# Altium schematic sheet LED controller - v1.1.SchDoc
size A4
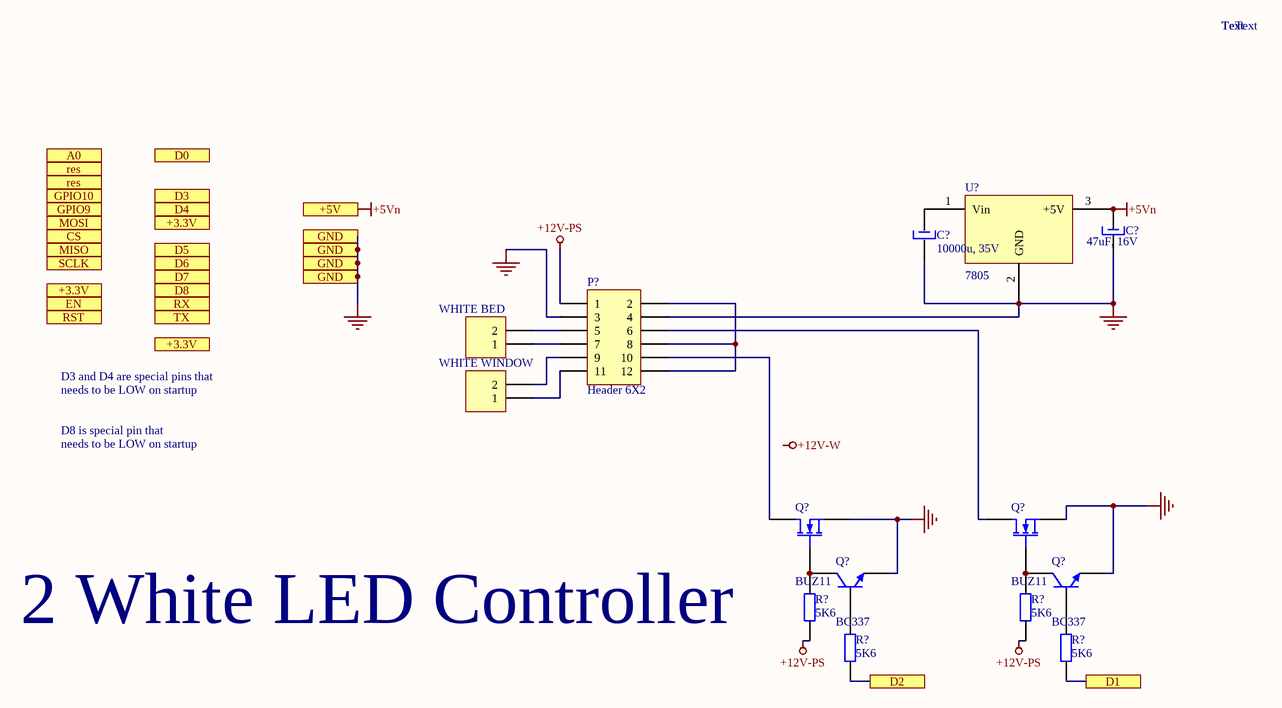
[diagram p0: LED controller - v1.1.SchDoc]

## Parts
(Parts that share a designator on the sheet are numbered #1, #2 ... from top to bottom, then left to right.)
C?#1  47uF, 16V  [Capacitor 10mikro]
C?#2  10000u, 35V  [Capacitor 10000u]
P?  Header 6X2  [HDR2X6]
Q?#1  BUZ11  [E3]
Q?#2  BUZ11  [E3]
Q?#3  BC337  [SOT-23]
Q?#4  BC337  [SOT-23]
R?#1  5K6  [SMD0805]
R?#2  5K6  [SMD0805]
R?#3  5K6  [SMD0805]
R?#4  5K6  [SMD0805]
U?  7805  [D-PAK16]
WHITE_BED  (no value)  [HDR1X2]
WHITE_WINDOW  (no value)  [HDR1X2]

## Ports
+3.3V, +5V, A0, CS, D0, D1, D2, D3, D4, D5, D6, D7, D8, EN, GND, GPIO9, GPIO10, MISO, MOSI, res, RST, RX, SCLK, TX

## Nets
+5Vn: C?#1.1 U?.3(+5V) ; port +5V
+12V-PS: P?.1 R?#1.2 R?#2.2
GND: C?#1.2 C?#2.2 P?.4 Q?#1.3(S) Q?#2.3(S) Q?#3.2(E) Q?#4.2(E) U?.2(GND) ; port GND
GND-PS: P?.3
D1: R?#4.2 ; port D1
D2: R?#3.2 ; port D2
NetC?#2_1: C?#2.1 U?.1(Vin)
NetP?_2: P?.2 P?.8 P?.12
NetP?_5: P?.5 WHITE_BED.2
NetP?_6: P?.6 Q?#2.1(D)
NetP?_7: P?.7 WHITE_BED.1
NetP?_9: P?.9 WHITE_WINDOW.2
NetP?_10: P?.10 Q?#1.1(D)
NetP?_11: P?.11 WHITE_WINDOW.1
NetQ?#1_2: Q?#1.2(G) Q?#3.3(C) R?#1.1
NetQ?#2_2: Q?#2.2(G) Q?#4.3(C) R?#2.1
NetQ?#3_1: Q?#3.1(B) R?#3.1
NetQ?#4_1: Q?#4.1(B) R?#4.1

## Notes on the sheet
- Text
- D3 and D4 are special pins that
- needs to be LOW on startup
- D8 is special pin that
- (near R?#1) 2 White LED Controller
- Labels drawn without touching a wire or pin: +12V-W

## Library data of the parts
C?#1 = Capacitor 10mikro
C?#2 = Capacitor 10000u
P? = Header 6X2: Header, 6-Pin, Dual row; LatestRevisionDate: 17-Jul-2002; LatestRevisionNote: Re-released for DXP Platform.; Publisher: Altium Limited
Q?#1 Q?#2 = MOSFET-N: N-Channel MOSFET; PackageDocument: 1995/1996; Published: 8-Jun-2000; LatestRevisionDate: 17-Jul-2002; LatestRevisionNote: Re-released for DXP Platform.; PackageReference: E3; Publisher: Altium Limited
Q?#3 Q?#4 = BC817
R?#1-R?#4 = Resistor 0.25W
WHITE_BED WHITE_WINDOW = Header 2: Header, 2-Pin; LatestRevisionDate: 17-Jul-2002; LatestRevisionNote: Re-released for DXP Platform.; Publisher: Altium Limited